# Altium schematic sheet Zynq_PL.SchDoc: Zynq PL
size A4; DrawnBy: Emre Can Damyanlı; Revision: A.1; SheetNumber: 6; SheetTotal: 7; ENG_APP_DATE: --/--/--; DSN_APP_DATE: --/--/--; CHK_APP_DATE: --/--/--
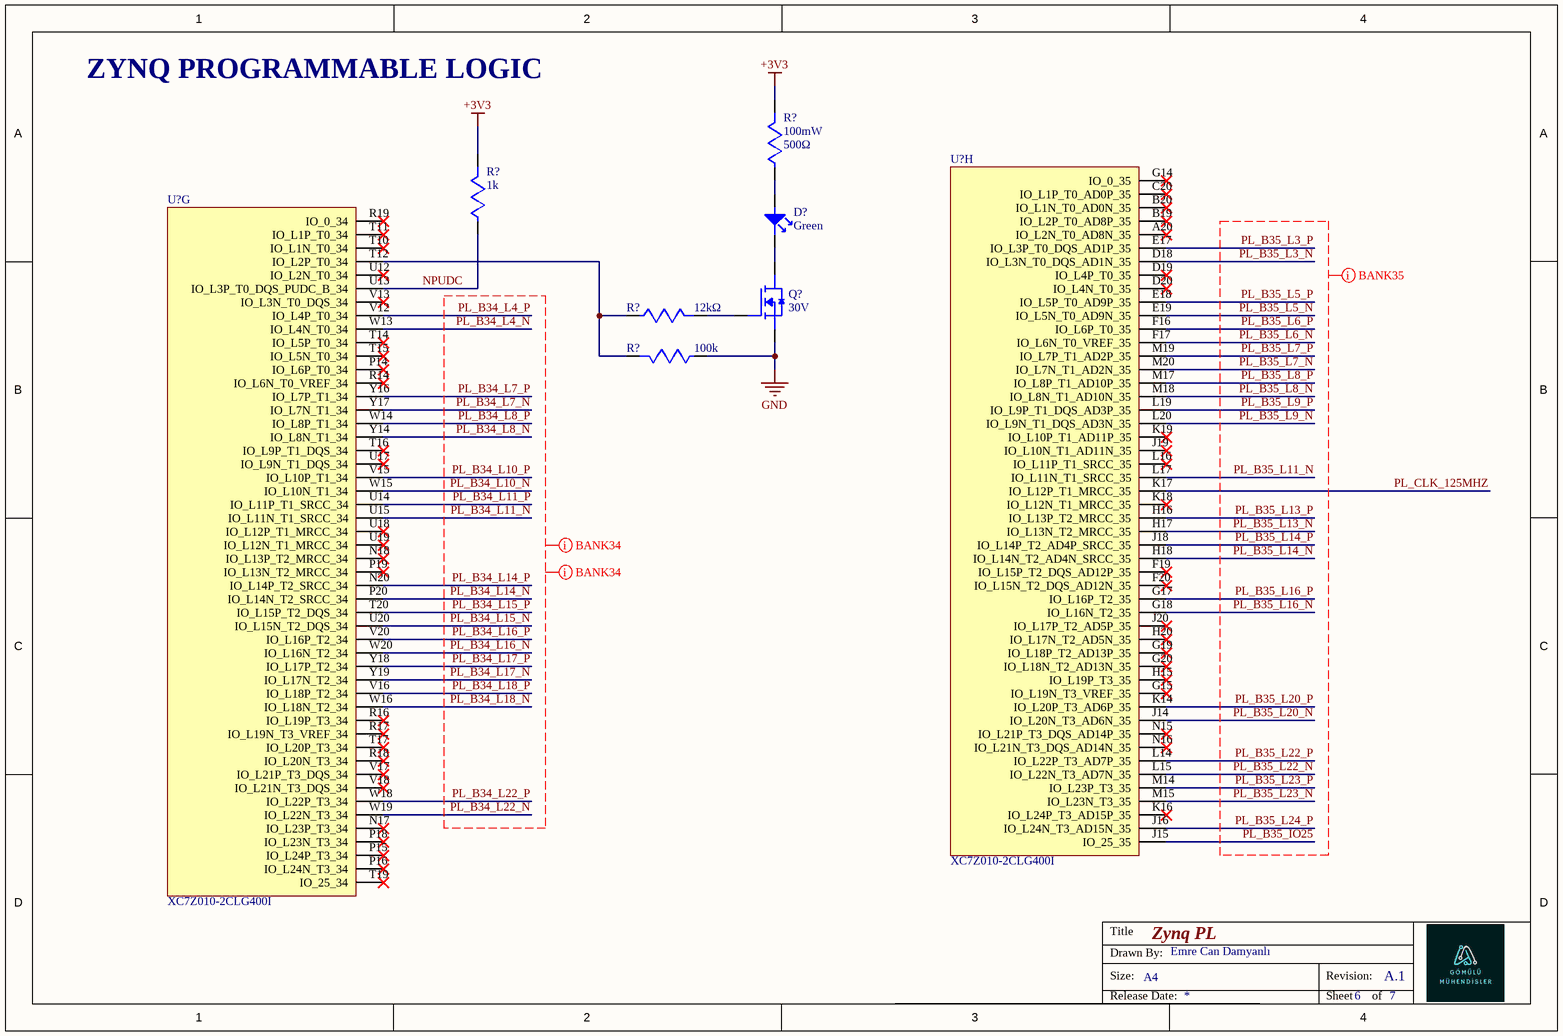
[diagram p0: Zynq_PL.SchDoc]

## Parts
(Parts that share a designator on the sheet are numbered #1, #2 ... from top to bottom, then left to right.)
D?  Color: Green  [LED_0603_GREEN]  (hidden comment: LTST-C191KGKT)
Q?  Drain to Source Voltage (Vdss): 30V  [CDSOT23]  (hidden comment: DMG3402L-7)
R?#1  value 500Ω  Power Rating: 100mW  [RESISTOR_0603]  (hidden comment: RT0603BRC07500RL)
R?#2  value 1k  [RESISTOR_0603]  (hidden comment: RC0603FR-071KL)
R?#3  value 12kΩ  [RESISTOR_0603]  (hidden comment: RC0603FR-0712KL)
R?#4  value 100k  [RESISTOR_0603]  (hidden comment: RC0603FR-07100KL)
U?#1  XC7Z010-2CLG400I  [BGA400C80P20X20_1700X1700X160]  (part H of 9)
U?#2  XC7Z010-2CLG400I  [BGA400C80P20X20_1700X1700X160]  (part G of 9)

## Nets
+3V3: R?#1.2 R?#2.2
GND: Q?.2(S) R?#4.1
NPUDC: R?#2.1 U?#2.U13(IO_L3P_T0_DQS_PUDC_B_34)
PL_B34_L4_N: U?#2.W13(IO_L4N_T0_34)
PL_B34_L4_P: U?#2.V12(IO_L4P_T0_34)
PL_B34_L7_N: U?#2.Y17(IO_L7N_T1_34)
PL_B34_L7_P: U?#2.Y16(IO_L7P_T1_34)
PL_B34_L8_N: U?#2.Y14(IO_L8N_T1_34)
PL_B34_L8_P: U?#2.W14(IO_L8P_T1_34)
PL_B34_L10_N: U?#2.W15(IO_L10N_T1_34)
PL_B34_L10_P: U?#2.V15(IO_L10P_T1_34)
PL_B34_L11_N: U?#2.U15(IO_L11N_T1_SRCC_34)
PL_B34_L11_P: U?#2.U14(IO_L11P_T1_SRCC_34)
PL_B34_L14_N: U?#2.P20(IO_L14N_T2_SRCC_34)
PL_B34_L14_P: U?#2.N20(IO_L14P_T2_SRCC_34)
PL_B34_L15_N: U?#2.U20(IO_L15N_T2_DQS_34)
PL_B34_L15_P: U?#2.T20(IO_L15P_T2_DQS_34)
PL_B34_L16_N: U?#2.W20(IO_L16N_T2_34)
PL_B34_L16_P: U?#2.V20(IO_L16P_T2_34)
PL_B34_L17_N: U?#2.Y19(IO_L17N_T2_34)
PL_B34_L17_P: U?#2.Y18(IO_L17P_T2_34)
PL_B34_L18_N: U?#2.W16(IO_L18N_T2_34)
PL_B34_L18_P: U?#2.V16(IO_L18P_T2_34)
PL_B34_L22_N: U?#2.W19(IO_L22N_T3_34)
PL_B34_L22_P: U?#2.W18(IO_L22P_T3_34)
PL_B35_IO25: U?#1.J15(IO_25_35)
PL_B35_L3_N: U?#1.D18(IO_L3N_T0_DQS_AD1N_35)
PL_B35_L3_P: U?#1.E17(IO_L3P_T0_DQS_AD1P_35)
PL_B35_L5_N: U?#1.E19(IO_L5N_T0_AD9N_35)
PL_B35_L5_P: U?#1.E18(IO_L5P_T0_AD9P_35)
PL_B35_L6_N: U?#1.F17(IO_L6N_T0_VREF_35)
PL_B35_L6_P: U?#1.F16(IO_L6P_T0_35)
PL_B35_L7_N: U?#1.M20(IO_L7N_T1_AD2N_35)
PL_B35_L7_P: U?#1.M19(IO_L7P_T1_AD2P_35)
PL_B35_L8_N: U?#1.M18(IO_L8N_T1_AD10N_35)
PL_B35_L8_P: U?#1.M17(IO_L8P_T1_AD10P_35)
PL_B35_L9_N: U?#1.L20(IO_L9N_T1_DQS_AD3N_35)
PL_B35_L9_P: U?#1.L19(IO_L9P_T1_DQS_AD3P_35)
PL_B35_L11_N: U?#1.L17(IO_L11N_T1_SRCC_35)
PL_B35_L13_N: U?#1.H17(IO_L13N_T2_MRCC_35)
PL_B35_L13_P: U?#1.H16(IO_L13P_T2_MRCC_35)
PL_B35_L14_N: U?#1.H18(IO_L14N_T2_AD4N_SRCC_35)
PL_B35_L14_P: U?#1.J18(IO_L14P_T2_AD4P_SRCC_35)
PL_B35_L16_N: U?#1.G18(IO_L16N_T2_35)
PL_B35_L16_P: U?#1.G17(IO_L16P_T2_35)
PL_B35_L20_N: U?#1.J14(IO_L20N_T3_AD6N_35)
PL_B35_L20_P: U?#1.K14(IO_L20P_T3_AD6P_35)
PL_B35_L22_N: U?#1.L15(IO_L22N_T3_AD7N_35)
PL_B35_L22_P: U?#1.L14(IO_L22P_T3_AD7P_35)
PL_B35_L23_N: U?#1.M15(IO_L23N_T3_35)
PL_B35_L23_P: U?#1.M14(IO_L23P_T3_35)
PL_B35_L24_P: U?#1.J16(IO_L24N_T3_AD15N_35)
PL_CLK_125MHZ: U?#1.K17(IO_L12P_T1_MRCC_35)
NetD?_1: D?.1 R?#1.1
NetD?_2: D?.2 Q?.3(D)
NetQ?_1: Q?.1(G) R?#3.2
NetR?#3_1: R?#3.1 R?#4.2 U?#2.T12(IO_L2P_T0_34)

Not connected (* = marked no-connect by the designer): U?#1 A20(IO_L2N_T0_AD8N_35)* B19(IO_L2P_T0_AD8P_35)* B20(IO_L1N_T0_AD0N_35)* C20(IO_L1P_T0_AD0P_35)* D19(IO_L4P_T0_35)* D20(IO_L4N_T0_35)* F19(IO_L15P_T2_DQS_AD12P_35)* F20(IO_L15N_T2_DQS_AD12N_35)* G14(IO_0_35)* G15(IO_L19N_T3_VREF_35)* G19(IO_L18P_T2_AD13P_35)* G20(IO_L18N_T2_AD13N_35)* H15(IO_L19P_T3_35)* H20(IO_L17N_T2_AD5N_35)* J19(IO_L10N_T1_AD11N_35)* J20(IO_L17P_T2_AD5P_35)* K16(IO_L24P_T3_AD15P_35)* K18(IO_L12N_T1_MRCC_35)* K19(IO_L10P_T1_AD11P_35)* L16(IO_L11P_T1_SRCC_35)* N15(IO_L21P_T3_DQS_AD14P_35)* N16(IO_L21N_T3_DQS_AD14N_35)*; U?#2 N17(IO_L23P_T3_34)* N18(IO_L13P_T2_MRCC_34)* P14(IO_L6P_T0_34)* P15(IO_L24P_T3_34)* P16(IO_L24N_T3_34)* P18(IO_L23N_T3_34)* P19(IO_L13N_T2_MRCC_34)* R14(IO_L6N_T0_VREF_34)* R16(IO_L19P_T3_34)* R17(IO_L19N_T3_VREF_34)* R18(IO_L20N_T3_34)* R19(IO_0_34)* T10(IO_L1N_T0_34)* T11(IO_L1P_T0_34)* T14(IO_L5P_T0_34)* T15(IO_L5N_T0_34)* T16(IO_L9P_T1_DQS_34)* T17(IO_L20P_T3_34)* T19(IO_25_34)* U12(IO_L2N_T0_34)* U17(IO_L9N_T1_DQS_34)* U18(IO_L12P_T1_MRCC_34)* U19(IO_L12N_T1_MRCC_34)* V13(IO_L3N_T0_DQS_34)* V17(IO_L21P_T3_DQS_34)* V18(IO_L21N_T3_DQS_34)*

## Layout directives
mark named BANK34: PL_B34_L4_N, PL_B34_L4_P, PL_B34_L7_N, PL_B34_L7_P, PL_B34_L8_N, PL_B34_L8_P, PL_B34_L10_N, PL_B34_L10_P, PL_B34_L11_N, PL_B34_L11_P, PL_B34_L14_N, PL_B34_L14_P, PL_B34_L15_N, PL_B34_L15_P, PL_B34_L16_N, PL_B34_L16_P, PL_B34_L17_N, PL_B34_L17_P, PL_B34_L18_N, PL_B34_L18_P, PL_B34_L22_N, PL_B34_L22_P
differential pair: PL_B34_L4_N, PL_B34_L4_P, PL_B34_L7_N, PL_B34_L7_P, PL_B34_L8_N, PL_B34_L8_P, PL_B34_L10_N, PL_B34_L10_P, PL_B34_L11_N, PL_B34_L11_P, PL_B34_L14_N, PL_B34_L14_P, PL_B34_L15_N, PL_B34_L15_P, PL_B34_L16_N, PL_B34_L16_P, PL_B34_L17_N, PL_B34_L17_P, PL_B34_L18_N, PL_B34_L18_P, PL_B34_L22_N, PL_B34_L22_P
mark named BANK35: PL_B35_IO25, PL_B35_L3_N, PL_B35_L3_P, PL_B35_L5_N, PL_B35_L5_P, PL_B35_L6_N, PL_B35_L6_P, PL_B35_L7_N, PL_B35_L7_P, PL_B35_L8_N, PL_B35_L8_P, PL_B35_L9_N, PL_B35_L9_P, PL_B35_L11_N, PL_B35_L13_N, PL_B35_L13_P, PL_B35_L14_N, PL_B35_L14_P, PL_B35_L16_N, PL_B35_L16_P, PL_B35_L20_N, PL_B35_L20_P, PL_B35_L22_N, PL_B35_L22_P, PL_B35_L23_N, PL_B35_L23_P, PL_B35_L24_P

## Notes on the sheet
- ZYNQ PROGRAMMABLE LOGIC
- Title
- Size:
- Drawn By:
- A4
- Revision:
- Release Date:
- Sheet
- of

## Library data of the parts
D? = LTST-C191KGKT: LTST-C191KGKT Lite-On LED, green, 18-71mcd, 130, 1.9V-2.4V SMD, 0603 1.6x0.8x0.55mm RoHS; Manufacturer: Vishay Lite-On; Lens Color: Colorless; Luminous Intensity: 35mcd; Viewing Angle: 130°; Lens Style: Flat,Rectangular,Colorless; Forward Voltage: 2V; Dominant Wavelength: 571nm; Test Current: 20mA; Lens Transparency: Clear; Wavelength: 574nm; Number of LEDs: 1; Max Power Dissipation: 75mW; Lens Size: 0.8mm; Supplier: Digi-Key; Supplier Part Number: 160-1446-1-ND; Manufacturer Part Number: LTST-C191KGKT; RoHS: Yes; Stock: 1655174; Pricing: 1=0,25, 10=0,136, 100=0,063, 500=0,05818, 1000=0,04557, 2000=0,0446 (USD); Mounting Technology: Surface Mount; Case/Package: 0603; Pins: 2; Case Code (Metric): 1608; Case Code (Imperial): 0603; Min Operating Temperature: -55°C; Max Operating Temperature: 85°C; Packaging: Tape and Reel; Series: -; Length: 1.6mm; Width: 0.8mm; Height: 0.65mm; RoHS Compliant: Yes; Lead Free: Lead Free; ComponentLink1URL: https://datasheet.ciiva.com/2109/ltst-c191kgkt-2109973.pdf?src-supplier=Digi-Key; ComponentLink1Description: https://datasheet.ciiva.com/2109/ltst-c191kgkt-2109973.pdf?src-supplier=Digi-Key
Q? = DMG3402L-7: MOSFET N-CH 30V 4A SOT23; Manufacturer: Diodes; Rds On Max: 52mR; Input Capacitance: 464pF; Rise Time: 1.6ns; Max Power Dissipation: 1.4W; Fall Time: 2ns; Turn-Off Delay Time: 10.3ns; Turn-On Delay Time: 1.9ns; Gate to Source Voltage (Vgs): 12V; Number of Channels: 1; Polarity: N-CHANNEL; Supplier: Digi-Key; Supplier Part Number: DMG3402L-7DICT-ND; Manufacturer Part Number: DMG3402L-7; RoHS: Yes; Category: MOSFETs; Stock: 1011067; Pricing: 1=0,42, 10=0,298, 100=0,1503, 500=0,13316, 1000=0,10363 (USD); Mounting Technology: Surface Mount; Case/Package: SOT-23; Pins: 3; Weight: 0.000282oz; Min Operating Temperature: -55°C; Max Operating Temperature: 150°C; Package Quantity: 3000; Packaging: Tape and Reel; Continuous Drain Current (ID): 4A; Drain to Source Resistance: 52mR; Series: -; RoHS Compliant: Yes; Lead Free: Lead Free; ComponentLink1URL: http://www.mouser.com/ds/2/115/DMG3402L-473526.pdf?src-supplier=Mouser; ComponentLink1Description: http://www.mouser.com/ds/2/115/DMG3402L-473526.pdf?src-supplier=Mouser; ComponentLink2URL: http://diodes.com/datasheets/DMG3402L.pdf?src-supplier=Avnet; ComponentLink2Description: http://diodes.com/datasheets/DMG3402L.pdf?src-supplier=Avnet
R?#1 = RT0603BRC07500RL: Fixed Resistor, Thin Film, 0.1W, 500ohm, 75V, 0.1% +/-Tol, 15ppm/Cel, Surface Mount, 0603; Manufacturer: Yageo Group; Temperature Coefficient: 15ppm/°C; Supplier: Farnell; Supplier Part Number: 4152629; Manufacturer Part Number: RT0603BRC07500RL; RoHS: Compliant; Category: Chip SMD Resistors; Stock: 4870; Pricing: 5000=0,12 (EUR); Case/Package: 0603; China RoHS: Non-Compliant; Composition: Thin Film; Height: 450µm; Lifecycle Status: Production; Max Operating Temperature: 155°C; Min Operating Temperature: -55°C; Mounting Technology: Surface Mount; Number of Terminals: 2; Packaging: Tape & Reel; Power Dissipation: 100mW; REACH SVHC: Yes; Tolerance: 0.1%; Voltage Rating: 75V; Width: 800µm; Working Voltage: 75V; ComponentLink1URL: https://datasheet.octopart.com:443/RT0603BRC07500RL-Yageo-datasheet-176402239.pdf?src-supplier=IHS; ComponentLink1Description: https://datasheet.octopart.com:443/RT0603BRC07500RL-Yageo-datasheet-176402239.pdf?src-supplier=IHS; ComponentLink2URL: https://datasheet.octopart.com:443/RT0603BRC07500RL-Yageo-datasheet-141265893.pdf?src-supplier=ODG+(Origin+Data+Global); ComponentLink2Description: https://datasheet.octopart.com:443/RT0603BRC07500RL-Yageo-datasheet-141265893.pdf?src-supplier=ODG+(Origin+Data+Global); ComponentLink3URL: https://datasheet.octopart.com:443/RT0603BRC07500RL-Yageo-datasheet-169971040.pdf?src-supplier=Upverter; ComponentLink3Description: https://datasheet.octopart.com:443/RT0603BRC07500RL-Yageo-datasheet-169971040.pdf?src-supplier=Upverter; ComponentLink4URL: https://datasheet.octopart.com:443/RT0603BRC07500RL-Yageo-datasheet-166250672.pdf?src-supplier=Future+Electronics; ComponentLink4Description: https://datasheet.octopart.com:443/RT0603BRC07500RL-Yageo-datasheet-166250672.pdf?src-supplier=Future+Electronics; ComponentLink5URL: https://datasheet.octopart.com/RT0603BRC07500RL-Yageo-datasheet-86813807.pdf; ComponentLink5Description: https://datasheet.octopart.com/RT0603BRC07500RL-Yageo-datasheet-86813807.pdf; ComponentLink6URL: http://sigma.octopart.com:80/rohs_statement/Yageo-company-2.pdf?src-supplier=Compliance+Statements; ComponentLink6Description: http://sigma.octopart.com:80/rohs_statement/Yageo-company-2.pdf?src-supplier=Compliance+Statements; ComponentLink7URL: http://sigma.octopart.com:80/conflict_mineral_statement/Yageo-company-3.pdf?src-supplier=Compliance+Statements; ComponentLink7Description: http://sigma.octopart.com:80/conflict_mineral_statement/Yageo-company-3.pdf?src-supplier=Compliance+Statements
R?#2 = RC0603FR-071KL: SMD Chip Resistor, 1 kOhm, ± 1%, 100 mW, 0603 [1608 Metric], Thick Film, General Purpose; Manufacturer: Yageo; Temperature Coefficient: 100ppm/°C; Power Rating: 100mW; Voltage Rating: 50V; Supplier: Digi-Key; Supplier Part Number: 311-1.00KHRCT-ND; Manufacturer Part Number: RC0603FR-071KL; RoHS: Yes; Category: Chip SMD Resistors; Stock: 18662657; Pricing: 1=0,1, 10=0,018, 50=0,0106, 100=0,0088, 500=0,00592, 1000=0,00505 (USD); Case/Package: 0603; Contact Plating: Tin,Matte; Case Code (Imperial): 0603; Case Code (Metric): 1608; Min Operating Temperature: -55°C; Max Operating Temperature: 155°C; Tolerance: 1%; Resistor Type: Thick Film; Packaging: Tape and Reel; Termination: SMD/SMT; Features: Moisture Resistant; Series: RC; Max Power Dissipation: 100mW; Number of Terminations: 2; Technology: THICK FILM; Resistance Tolerance: 1%; Construction: Rectangular; Length: 1.6mm; Height: 0.45mm; Depth: 0.8mm; Reach SVHC Compliant: No; Military Standard: Not; RoHS Compliant: Yes
R?#3 = RC0603FR-0712KL: 100mW Thick Film Resistors 75V ±100ppm/℃ ±1% 12kΩ 0603 Chip Resistor - Surface Mount ROHS; Manufacturer: Yageo Group; Temperature Coefficient: 100ppm/°C; Voltage Rating: 50V; Supplier: Farnell; Supplier Part Number: 9238611; Manufacturer Part Number: RC0603FR-0712KL; RoHS: Compliant; Category: Chip SMD Resistors; Stock: 298850; Pricing: 10=0,0061, 100=0,0052, 500=0,0048, 1000=0,0043, 2500=0,0036 (EUR); Case/Package: 0603; Case Code (Imperial): 0603; Case Code (Metric): 1608; China RoHS: Non-Compliant; Composition: Thick Film; Depth: 800µm; Features: Moisture Resistant; Height: 450µm; Lead Free: Lead Free; Length: 1.6mm; Lifecycle Status: Production; Max Operating Temperature: 155°C; Max Power Dissipation: 100mW; Military Standard: Not; Min Operating Temperature: -55°C; Mounting Technology: Surface Mount; Pins: 2; Number of Terminals: 2; Number of Terminations: 2; Packaging: Tape and Reel; Power Dissipation: 100mW; Power Rating: 100mW; REACH SVHC: Yes; Schedule B: 8533210045, 8533210045|8533210045|8533210045|8533210045|8533210045; Termination: SMD/SMT; Tolerance: 1%; Voltage Rating (DC): 50V; Width: 800µm; Working Voltage: 75V; ComponentLink1URL: https://datasheet.octopart.com:443/RC0603FR-0712KL-Yageo-datasheet-175887523.pdf?src-supplier=IHS; ComponentLink1Description: https://datasheet.octopart.com:443/RC0603FR-0712KL-Yageo-datasheet-175887523.pdf?src-supplier=IHS; ComponentLink2URL: https://datasheet.octopart.com:443/RC0603FR-0712KL-Yageo-datasheet-8328172.pdf?src-supplier=Newark; ComponentLink2Description: https://datasheet.octopart.com:443/RC0603FR-0712KL-Yageo-datasheet-8328172.pdf?src-supplier=Newark; ComponentLink3URL: https://datasheet.octopart.com:443/RC0603FR-0712KL-Yageo-datasheet-175423674.pdf?src-supplier=Newark; ComponentLink3Description: https://datasheet.octopart.com:443/RC0603FR-0712KL-Yageo-datasheet-175423674.pdf?src-supplier=Newark; ComponentLink4URL: https://datasheet.octopart.com:443/RC0603FR-0712KL-Yageo-datasheet-34211833.pdf?src-supplier=Newark; ComponentLink4Description: https://datasheet.octopart.com:443/RC0603FR-0712KL-Yageo-datasheet-34211833.pdf?src-supplier=Newark; ComponentLink5URL: https://datasheet.octopart.com:443/RC0603FR-0712KL-Yageo-datasheet-62067350.pdf?src-supplier=element14+APAC; ComponentLink5Description: https://datasheet.octopart.com:443/RC0603FR-0712KL-Yageo-datasheet-62067350.pdf?src-supplier=element14+APAC; ComponentLink6URL: https://datasheet.octopart.com:443/RC0603FR-0712KL-Yageo-datasheet-103092701.pdf?src-supplier=Upverter; ComponentLink6Description: https://datasheet.octopart.com:443/RC0603FR-0712KL-Yageo-datasheet-103092701.pdf?src-supplier=Upverter; ComponentLink7URL: https://datasheet.octopart.com:443/RC0603FR-0712KL-Yageo-datasheet-141435368.pdf?src-supplier=Upverter; ComponentLink7Description: https://datasheet.octopart.com:443/RC0603FR-0712KL-Yageo-datasheet-141435368.pdf?src-supplier=Upverter; ComponentLink8URL: https://datasheet.octopart.com:443/RC0603FR-0712KL-Yageo-Group-datasheet-190305687.pdf?src-supplier=Future+Electronics; ComponentLink8Description: https://datasheet.octopart.com:443/RC0603FR-0712KL-Yageo-Group-datasheet-190305687.pdf?src-supplier=Future+Electronics; ComponentLink9URL: https://datasheet.octopart.com:443/RC0603FR-0712KL-Yageo-datasheet-164759695.pdf?src-supplier=Future+Electronics; ComponentLink9Description: https://datasheet.octopart.com:443/RC0603FR-0712KL-Yageo-datasheet-164759695.pdf?src-supplier=Future+Electronics; ComponentLink10URL: https://datasheet.octopart.com:443/RC0603FR-0712KL-Yageo-datasheet-137700087.pdf?src-supplier=Future+Electronics; ComponentLink10Description: https://datasheet.octopart.com:443/RC0603FR-0712KL-Yageo-datasheet-137700087.pdf?src-supplier=Future+Electronics; ComponentLink11URL: https://datasheet.octopart.com:443/RC0603FR0712KL-Yageo-datasheet-27584510.pdf?src-supplier=Future+Electronics; ComponentLink11Description: https://datasheet.octopart.com:443/RC0603FR0712KL-Yageo-datasheet-27584510.pdf?src-supplier=Future+Electronics; ComponentLink12URL: https://datasheet.octopart.com:443/RC0603FR-0712KL-Yageo-datasheet-15599030.pdf?src-supplier=Future+Electronics; ComponentLink12Description: https://datasheet.octopart.com:443/RC0603FR-0712KL-Yageo-datasheet-15599030.pdf?src-supplier=Future+Electronics; ComponentLink13URL: https://datasheet.octopart.com:443/RC0603FR-0712KL-Yageo-datasheet-12596169.pdf?src-supplier=Future+Electronics; ComponentLink13Description: https://datasheet.octopart.com:443/RC0603FR-0712KL-Yageo-datasheet-12596169.pdf?src-supplier=Future+Electronics; ComponentLink14URL: https://datasheet.octopart.com:443/RC0603FR-0712KL-Yageo-datasheet-8324193.pdf?src-supplier=Future+Electronics; ComponentLink14Description: https://datasheet.octopart.com:443/RC0603FR-0712KL-Yageo-datasheet-8324193.pdf?src-supplier=Future+Electronics; ComponentLink15URL: https://datasheet.octopart.com:443/RC0603FR-0712KL-Yageo-Group-datasheet-176638170.pdf?src-supplier=Farnell; ComponentLink15Description: https://datasheet.octopart.com:443/RC0603FR-0712KL-Yageo-Group-datasheet-176638170.pdf?src-supplier=Farnell; ComponentLink16URL: https://datasheet.octopart.com/RC0603FR-0712KL-Yageo-datasheet-73766026.pdf; ComponentLink16Description: https://datasheet.octopart.com/RC0603FR-0712KL-Yageo-datasheet-73766026.pdf; ComponentLink17URL: https://datasheet.octopart.com:443/RC0603FR-0712KL-Yageo-datasheet-30459151.pdf?src-supplier=Seeed+Studio; ComponentLink17Description: https://datasheet.octopart.com:443/RC0603FR-0712KL-Yageo-datasheet-30459151.pdf?src-supplier=Seeed+Studio; ComponentLink18URL: https://datasheet.octopart.com:443/RC0603FR-0712KL-Yageo-datasheet-118562.pdf?src-supplier=DigiKey; ComponentLink18Description: https://datasheet.octopart.com:443/RC0603FR-0712KL-Yageo-datasheet-118562.pdf?src-supplier=DigiKey; ComponentLink19URL: http://sigma.octopart.com:80/conflict_mineral_statement/Yageo-company-3.pdf?src-supplier=Compliance+Statements; ComponentLink19Description: http://sigma.octopart.com:80/conflict_mineral_statement/Yageo-company-3.pdf?src-supplier=Compliance+Statements; ComponentLink20URL: http://sigma.octopart.com:80/rohs_statement/Yageo-company-2.pdf?src-supplier=Compliance+Statements; ComponentLink20Description: http://sigma.octopart.com:80/rohs_statement/Yageo-company-2.pdf?src-supplier=Compliance+Statements
R?#4 = RC0603FR-07100KL: SMD Chip Resistor, 100 kOhm, ± 1%, 100 mW, 0603 [1608 Metric], Thick Film, General Purpose; Manufacturer: Yageo; Temperature Coefficient: 100ppm/°C; Voltage Rating (DC): 50V; Power Rating: 100mW; Supplier: Digi-Key; Supplier Part Number: 311-100KHRCT-ND; Manufacturer Part Number: RC0603FR-07100KL; RoHS: Yes; Category: Chip SMD Resistors; Stock: 3229176; Pricing: 1=0,1, 10=0,018, 50=0,0106, 100=0,0088, 500=0,00592, 1000=0,00505 (USD); Case/Package: 0603; Pins: 2; Case Code (Imperial): 0603; Case Code (Metric): 1608; Min Operating Temperature: -55°C; Max Operating Temperature: 155°C; Tolerance: 1%; Resistor Type: Thick Film; Packaging: Tape and Reel; Voltage Rating: 50V; Termination: SMD/SMT; Number of Terminations: 2; Features: Moisture Resistant; Series: RC; Max Power Dissipation: 100mW; Resistance Tolerance: 1%; Construction: Rectangular; Technology: THICK FILM; Length: 1.6mm; Width: 0.8mm; Height: 0.45mm; Depth: 0.8mm; Reach SVHC Compliant: No; Military Standard: Not; RoHS Compliant: Yes
U?#1 U?#2 = XC7Z010-2CLG400I: MPU Zynq-7000 Thumb-2 32-Bit 733MHz 1.2V/3.3V 400-Pin CS-BGA; Manufacturer: AMD; Core Architecture: ARM; Data Bus Width: 32b; Frequency: 766MHz; Interface: CAN, EBI/EMI, Ethernet, I2C, MMC, SD, SDIO, SPI, UART, USART, USB; Max Supply Voltage: 1.05V; Min Supply Voltage: 950mV; Number of I/Os: 130; Operating Supply Voltage: 1V; Peripherals: DMA; Speed Grade: -2; Supplier: Farnell; Supplier Part Number: 2831085; Manufacturer Part Number: XC7Z010-2CLG400I; RoHS: Compliant; Category: System on Chip (SoC); Stock: 89; Pricing: 1=78,2 (EUR); Case/Package: BGA; China RoHS: Compliant; Contact Plating: Copper, Silver, Tin; Height - Seated (Max): 1.6mm; Length: 17mm; Lifecycle Status: Production; Clock Frequency: 733MHz; Max Operating Temperature: 100°C; Min Operating Temperature: -40°C; Pins: 400; Number of Terminals: 400; Radiation Hardening: No; REACH SVHC: Yes; Terminal Pitch: 800µm; Width: 17mm; ComponentLink1URL: https://datasheet.octopart.com:443/XC7Z010-2CLG400I-AMD-datasheet-159618399.pdf?src-supplier=IHS; ComponentLink1Description: https://datasheet.octopart.com:443/XC7Z010-2CLG400I-AMD-datasheet-159618399.pdf?src-supplier=IHS; ComponentLink2URL: https://datasheet.octopart.com:443/XC7Z010-2CLG400I-Xilinx-datasheet-134531205.pdf?src-supplier=Upverter; ComponentLink2Description: https://datasheet.octopart.com:443/XC7Z010-2CLG400I-Xilinx-datasheet-134531205.pdf?src-supplier=Upverter; ComponentLink3URL: https://datasheet.octopart.com:443/XC7Z010-2CLG400I-AMD-datasheet-101617038.pdf?src-supplier=Farnell; ComponentLink3Description: https://datasheet.octopart.com:443/XC7Z010-2CLG400I-AMD-datasheet-101617038.pdf?src-supplier=Farnell; ComponentLink4URL: https://datasheet.octopart.com:443/XC7Z010-2CLG400I-Xilinx-datasheet-159009919.pdf?src-supplier=Augswan; ComponentLink4Description: https://datasheet.octopart.com:443/XC7Z010-2CLG400I-Xilinx-datasheet-159009919.pdf?src-supplier=Augswan